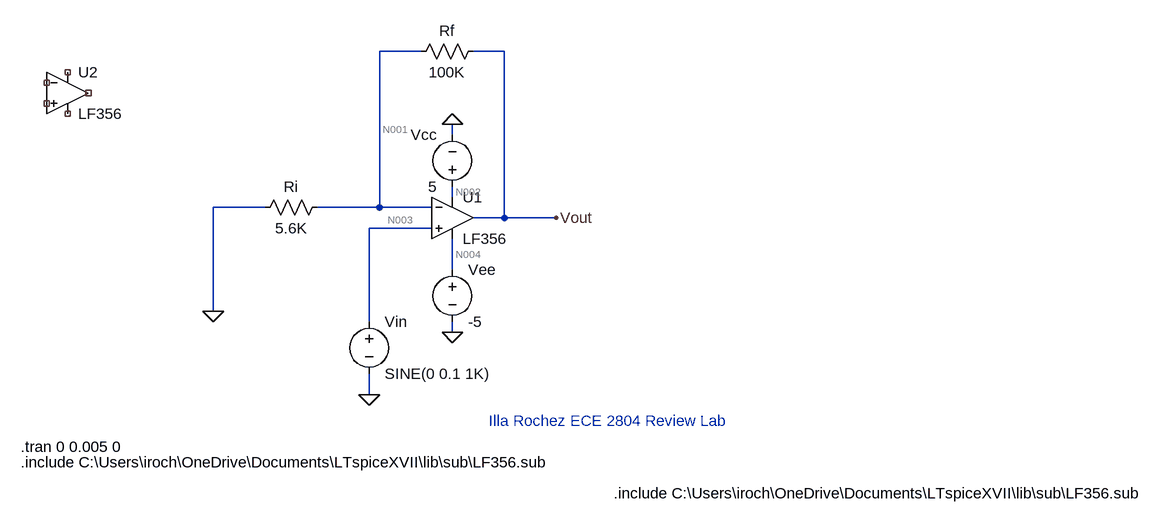
[diagram p0: schematic review_amps.asc]
review_amps.asc, the LTspice schematic file:
Version 4
SHEET 1 1488 680
WIRE 272 -240 208 -240
WIRE 400 -240 352 -240
WIRE 320 -112 320 -128
WIRE 320 -16 320 -32
WIRE 32 0 -48 0
WIRE 208 0 208 -240
WIRE 208 0 112 0
WIRE 288 0 208 0
WIRE 400 16 400 -240
WIRE 400 16 352 16
WIRE 480 16 400 16
WIRE 288 32 192 32
WIRE 320 96 320 48
WIRE -48 160 -48 0
WIRE 192 176 192 32
WIRE 320 192 320 176
WIRE 192 288 192 256
FLAG -48 160 0
FLAG 192 288 0
FLAG 480 16 Vout
FLAG 320 -128 0
FLAG 320 192 0
SYMBOL res 128 -16 R90
WINDOW 0 0 56 VBottom 2
WINDOW 3 32 56 VTop 2
SYMATTR InstName Ri
SYMATTR Value 5.6K
SYMBOL res 368 -256 R90
WINDOW 0 0 56 VBottom 2
WINDOW 3 32 56 VTop 2
SYMATTR InstName Rf
SYMATTR Value 100K
SYMBOL voltage 192 160 R0
WINDOW 123 0 0 Left 0
WINDOW 39 0 0 Left 0
SYMATTR InstName Vin
SYMATTR Value SINE(0 0.1 1K)
SYMBOL Opamps\\opamp2 320 -48 R0
SYMATTR InstName U1
SYMATTR Value LF356
SYMBOL voltage 320 -16 R180
WINDOW 0 24 96 Left 2
WINDOW 3 24 16 Left 2
WINDOW 123 0 0 Left 0
WINDOW 39 0 0 Left 0
SYMATTR InstName Vcc
SYMATTR Value 5
SYMBOL voltage 320 80 R0
WINDOW 123 0 0 Left 0
WINDOW 39 0 0 Left 0
SYMATTR InstName Vee
SYMATTR Value -5
SYMBOL Opamps\\opamp2 -272 -240 R0
SYMATTR InstName U2
SYMATTR Value LF356
TEXT 376 328 Left 2 ;Illa Rochez ECE 2804 Review Lab
TEXT -344 368 Left 2 !.tran 0 0.005 0
TEXT -344 392 Left 2 !.include C:\\Users\\iroch\\OneDrive\\Documents\\LTspiceXVII\\lib\\sub\\LF356.sub
TEXT 568 440 Left 2 !.include C:\\Users\\iroch\\OneDrive\\Documents\\LTspiceXVII\\lib\\sub\\LF356.sub

The netlist it stands for:
* review_amps.asc
Ri N001 0 5.6K
Rf Vout N001 100K
Vin N003 0 SINE(0 0.1 1K)
XU1 N003 N001 N002 N004 Vout LF356  ; pins In+ In- V+ V- OUT
Vcc N002 0 5
Vee N004 0 -5
XU2 NC_01 NC_02 NC_03 NC_04 NC_05 LF356  ; pins In+ In- V+ V- OUT
* Illa Rochez ECE 2804 Review Lab
.tran 0 0.005 0
.include C:\Users\iroch\OneDrive\Documents\LTspiceXVII\lib\sub\LF356.sub
.include C:\Users\iroch\OneDrive\Documents\LTspiceXVII\lib\sub\LF356.sub
.backanno
.end

* Results of the author's LTspice run, read from the files saved beside the schematic
* Operating Point, zero values left out:
*   V(n001) = 3 mV
*   V(vout) = 56.57 mV
*   V(n002) = 5 V
*   V(n004) = -5 V
*   I(Rf) = 535.7 nA
*   I(Ri) = 535.7 nA
*   I(Vee) = 4.85 mA
*   I(Vcc) = -4.851 mA
*   I(Vin) = -31 pA
*   Ix(u1:1) = 31 pA
*   Ix(u1:2) = 37 pA
*   Ix(u1:99) = 4.851 mA
*   Ix(u1:50) = -4.85 mA
*   Ix(u1:28) = -535.7 nA
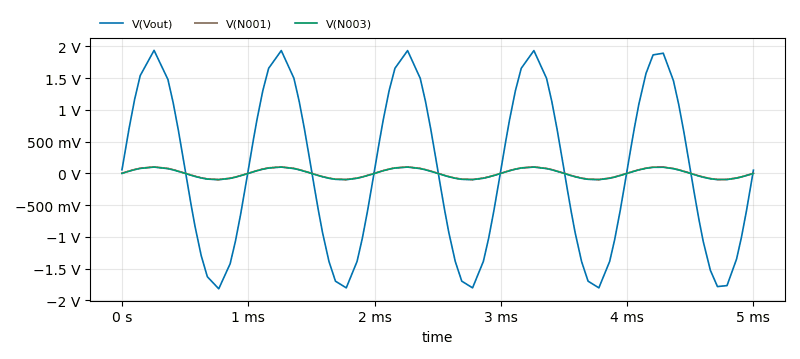
[diagram p1: Transient Analysis of review_amps.asc, plotted from the saved traces]
* Transient Analysis, 1 run:
*   V(Vout): min -1.818 V, max 1.939 V, average 52.72 mV, rms 1.314 V, last 51.05 mV
*   V(N001): min -96.4 mV, max 102.8 mV, average 2.795 mV, rms 69.67 mV, last 2.707 mV
*   V(N003): min -99.4 mV, max 99.83 mV, average -204.4 µV, rms 69.64 mV, last 0 V